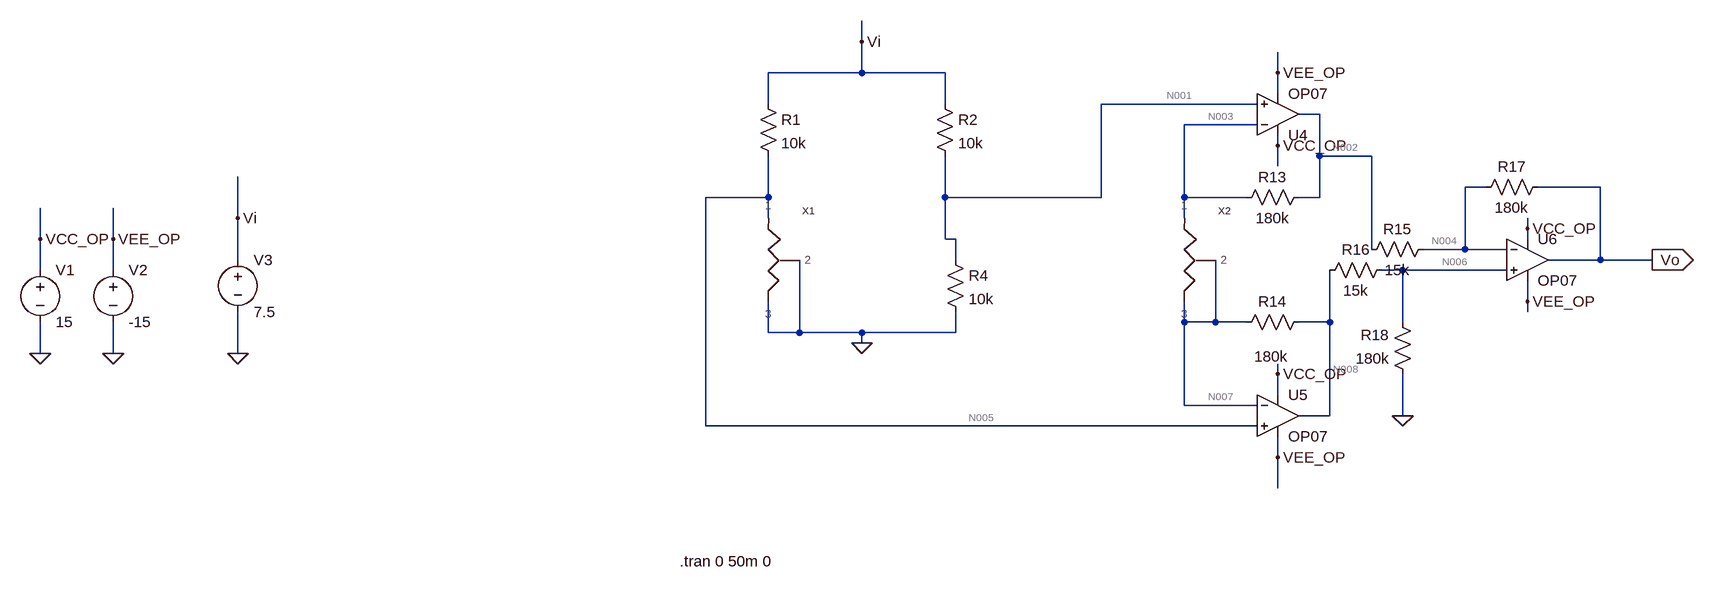
[diagram p0: schematic 1_5.asc]
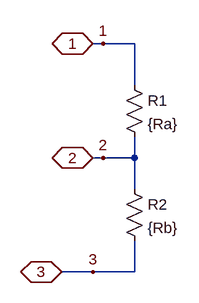
[diagram p1: sub-circuit dian_wei_qi.asc]
1_5.asc, the LTspice schematic file:
Version 4
SHEET 1 2984 784
WIRE 1680 -32 1680 -64
WIRE 1680 16 1680 -32
WIRE 1680 16 1536 16
WIRE 1808 16 1680 16
WIRE 2320 16 2320 -16
WIRE 2320 48 2320 16
WIRE 1536 64 1536 16
WIRE 1808 64 1808 16
WIRE 2288 64 2048 64
WIRE 2384 80 2352 80
WIRE 2288 96 2176 96
WIRE 2320 128 2320 112
WIRE 2384 144 2384 80
WIRE 2464 144 2384 144
WIRE 2320 160 2320 128
WIRE 2640 192 2608 192
WIRE 2816 192 2720 192
WIRE 1536 208 1536 144
WIRE 1536 208 1440 208
WIRE 1808 208 1808 144
WIRE 2048 208 2048 64
WIRE 2048 208 1808 208
WIRE 2176 208 2176 96
WIRE 2272 208 2176 208
WIRE 2384 208 2384 144
WIRE 2384 208 2352 208
WIRE 720 240 720 176
WIRE 1536 240 1536 208
WIRE 2176 240 2176 208
WIRE 2704 256 2704 240
WIRE 416 272 416 224
WIRE 528 272 528 224
WIRE 1808 272 1808 208
WIRE 1824 272 1808 272
WIRE 2704 272 2704 256
WIRE 2464 288 2464 144
WIRE 2608 288 2608 192
WIRE 2608 288 2544 288
WIRE 2672 288 2608 288
WIRE 720 304 720 240
WIRE 1824 304 1824 272
WIRE 2816 304 2816 192
WIRE 2816 304 2736 304
WIRE 2896 304 2816 304
WIRE 416 320 416 272
WIRE 528 320 528 272
WIRE 2512 320 2480 320
WIRE 2672 320 2512 320
WIRE 2704 368 2704 336
WIRE 2704 384 2704 368
WIRE 2176 400 2176 368
WIRE 2224 400 2224 304
WIRE 2224 400 2176 400
WIRE 2272 400 2224 400
WIRE 2400 400 2400 320
WIRE 2400 400 2352 400
WIRE 2512 400 2512 320
WIRE 1536 416 1536 368
WIRE 1584 416 1584 304
WIRE 1584 416 1536 416
WIRE 1680 416 1584 416
WIRE 1824 416 1824 384
WIRE 1824 416 1680 416
WIRE 1680 432 1680 416
WIRE 416 448 416 400
WIRE 528 448 528 400
WIRE 720 448 720 384
WIRE 2320 480 2320 464
WIRE 2320 512 2320 480
WIRE 2176 528 2176 400
WIRE 2288 528 2176 528
WIRE 2400 544 2400 400
WIRE 2400 544 2352 544
WIRE 2512 544 2512 480
WIRE 1440 560 1440 208
WIRE 2288 560 1440 560
WIRE 2320 608 2320 576
WIRE 2320 656 2320 608
FLAG 416 448 0
FLAG 528 448 0
FLAG 416 272 VCC_OP
FLAG 528 272 VEE_OP
FLAG 2512 544 0
FLAG 2320 128 VCC_OP
FLAG 2704 256 VCC_OP
FLAG 2320 480 VCC_OP
FLAG 2320 16 VEE_OP
FLAG 2704 368 VEE_OP
FLAG 2320 608 VEE_OP
FLAG 2896 304 Vo
IOPIN 2896 304 Out
FLAG 720 448 0
FLAG 1680 432 0
FLAG 1680 -32 Vi
FLAG 720 240 Vi
SYMBOL voltage 416 304 R0
WINDOW 123 0 0 Left 0
WINDOW 39 0 0 Left 0
SYMATTR InstName V1
SYMATTR Value 15
SYMBOL voltage 528 304 R0
WINDOW 123 0 0 Left 0
WINDOW 39 0 0 Left 0
SYMATTR InstName V2
SYMATTR Value -15
SYMBOL OpAmps\\OP07 2320 144 M180
SYMATTR InstName U4
SYMBOL OpAmps\\OP07 2320 480 R0
SYMATTR InstName U5
SYMBOL OpAmps\\OP07 2704 240 R0
SYMATTR InstName U6
SYMBOL res 2368 192 R90
WINDOW 0 0 56 VBottom 2
WINDOW 3 32 56 VTop 2
SYMATTR InstName R13
SYMATTR Value 180k
SYMBOL res 2368 384 R90
WINDOW 0 0 56 VBottom 2
WINDOW 3 53 58 VTop 2
SYMATTR InstName R14
SYMATTR Value 180k
SYMBOL res 2560 272 R90
WINDOW 0 0 56 VBottom 2
WINDOW 3 32 56 VTop 2
SYMATTR InstName R15
SYMATTR Value 15k
SYMBOL res 2496 304 R90
WINDOW 0 0 56 VBottom 2
WINDOW 3 32 56 VTop 2
SYMATTR InstName R16
SYMATTR Value 15k
SYMBOL res 2736 176 R90
WINDOW 0 0 56 VBottom 2
WINDOW 3 32 56 VTop 2
SYMATTR InstName R17
SYMATTR Value 180k
SYMBOL res 2528 496 R180
WINDOW 0 36 76 Left 2
WINDOW 3 36 40 Left 2
SYMATTR InstName R18
SYMATTR Value 180k
SYMBOL voltage 720 288 R0
WINDOW 123 0 0 Left 0
WINDOW 39 0 0 Left 0
SYMATTR InstName V3
SYMATTR Value 7.5
SYMBOL res 1520 48 R0
SYMATTR InstName R1
SYMATTR Value 10k
SYMBOL res 1792 48 R0
SYMATTR InstName R2
SYMATTR Value 10k
SYMBOL res 1808 288 R0
SYMATTR InstName R4
SYMATTR Value 10k
SYMBOL dian_wei_qi 1520 304 R0
SYMATTR InstName X1
SYMATTR SpiceLine Ra=10.1k,Rb=0.01
SYMBOL dian_wei_qi 2160 304 R0
SYMATTR InstName X2
SYMATTR SpiceLine Ra=16.96k,Rb=0.01
TEXT 1400 768 Left 2 !.tran 0 50m 0

dian_wei_qi.asc, the sub-circuit schematic file:
Version 4
SHEET 1 880 680
WIRE 144 -32 128 -32
WIRE 192 -32 144 -32
WIRE 192 32 192 -32
WIRE 144 144 128 144
WIRE 192 144 192 112
WIRE 192 144 144 144
WIRE 192 192 192 144
WIRE 128 320 80 320
WIRE 192 320 192 272
WIRE 192 320 128 320
FLAG 144 -32 1
FLAG 144 144 2
FLAG 128 320 3
FLAG 128 -32 1
IOPIN 128 -32 BiDir
FLAG 128 144 2
IOPIN 128 144 BiDir
FLAG 80 320 3
IOPIN 80 320 BiDir
SYMBOL res 176 16 R0
SYMATTR InstName R1
SYMATTR Value {Ra}
SYMBOL res 176 176 R0
SYMATTR InstName R2
SYMATTR Value {Rb}

The netlist it stands for:
* 1_5.asc
V1 VCC_OP 0 15
V2 VEE_OP 0 -15
XU4 N001 N003 VCC_OP VEE_OP N002 LT1001  ; OP07, pins In+ In- V+ V- OUT
XU5 N005 N007 VCC_OP VEE_OP N008 LT1001  ; OP07, pins In+ In- V+ V- OUT
XU6 N006 N004 VCC_OP VEE_OP Vo LT1001  ; OP07, pins In+ In- V+ V- OUT
R13 N002 N003 180k
R14 N008 N007 180k
R15 N004 N002 15k
R16 N006 N008 15k
R17 Vo N004 180k
R18 0 N006 180k
V3 Vi 0 7.5
R1 Vi N005 10k
R2 Vi N001 10k
R4 N001 0 10k
XX1 N005 0 0 dian_wei_qi params: Ra=10.1k,Rb=0.01
XX2 N003 N007 N007 dian_wei_qi params: Ra=16.96k,Rb=0.01

* block symbol definitions
.subckt dian_wei_qi 1 2 3
R1 1 2 {Ra}
R2 2 3 {Rb}
.ends dian_wei_qi

.tran 0 50m 0
.lib LTC.lib
.backanno
.end

* Results of the author's LTspice run, read from the files saved beside the schematic
* Operating Point, zero values left out:
*   V(vcc_op) = 15 V
*   V(vee_op) = -15 V
*   V(n003) = 3.75 V
*   V(n001) = 3.75 V
*   V(n002) = 3.552 V
*   V(n007) = 3.769 V
*   V(n005) = 3.769 V
*   V(n008) = 3.967 V
*   V(n004) = 3.662 V
*   V(n006) = 3.662 V
*   V(vo) = 4.976 V
*   V(vi) = 7.5 V
*   I(R4) = 375 µA
*   I(R2) = 375 µA
*   I(R1) = 373.1 µA
*   I(R18) = -20.34 µA
*   I(R17) = 7.302 µA
*   I(R16) = -20.34 µA
*   I(R15) = 7.302 µA
*   I(R14) = 1.1 µA
*   I(R13) = -1.1 µA
*   I(V3) = -748.1 µA
*   I(V2) = 6.74 mA
*   I(V1) = -6.76 mA